# EAGLE schematic motor_connector_board (EAGLE 8.5.0)
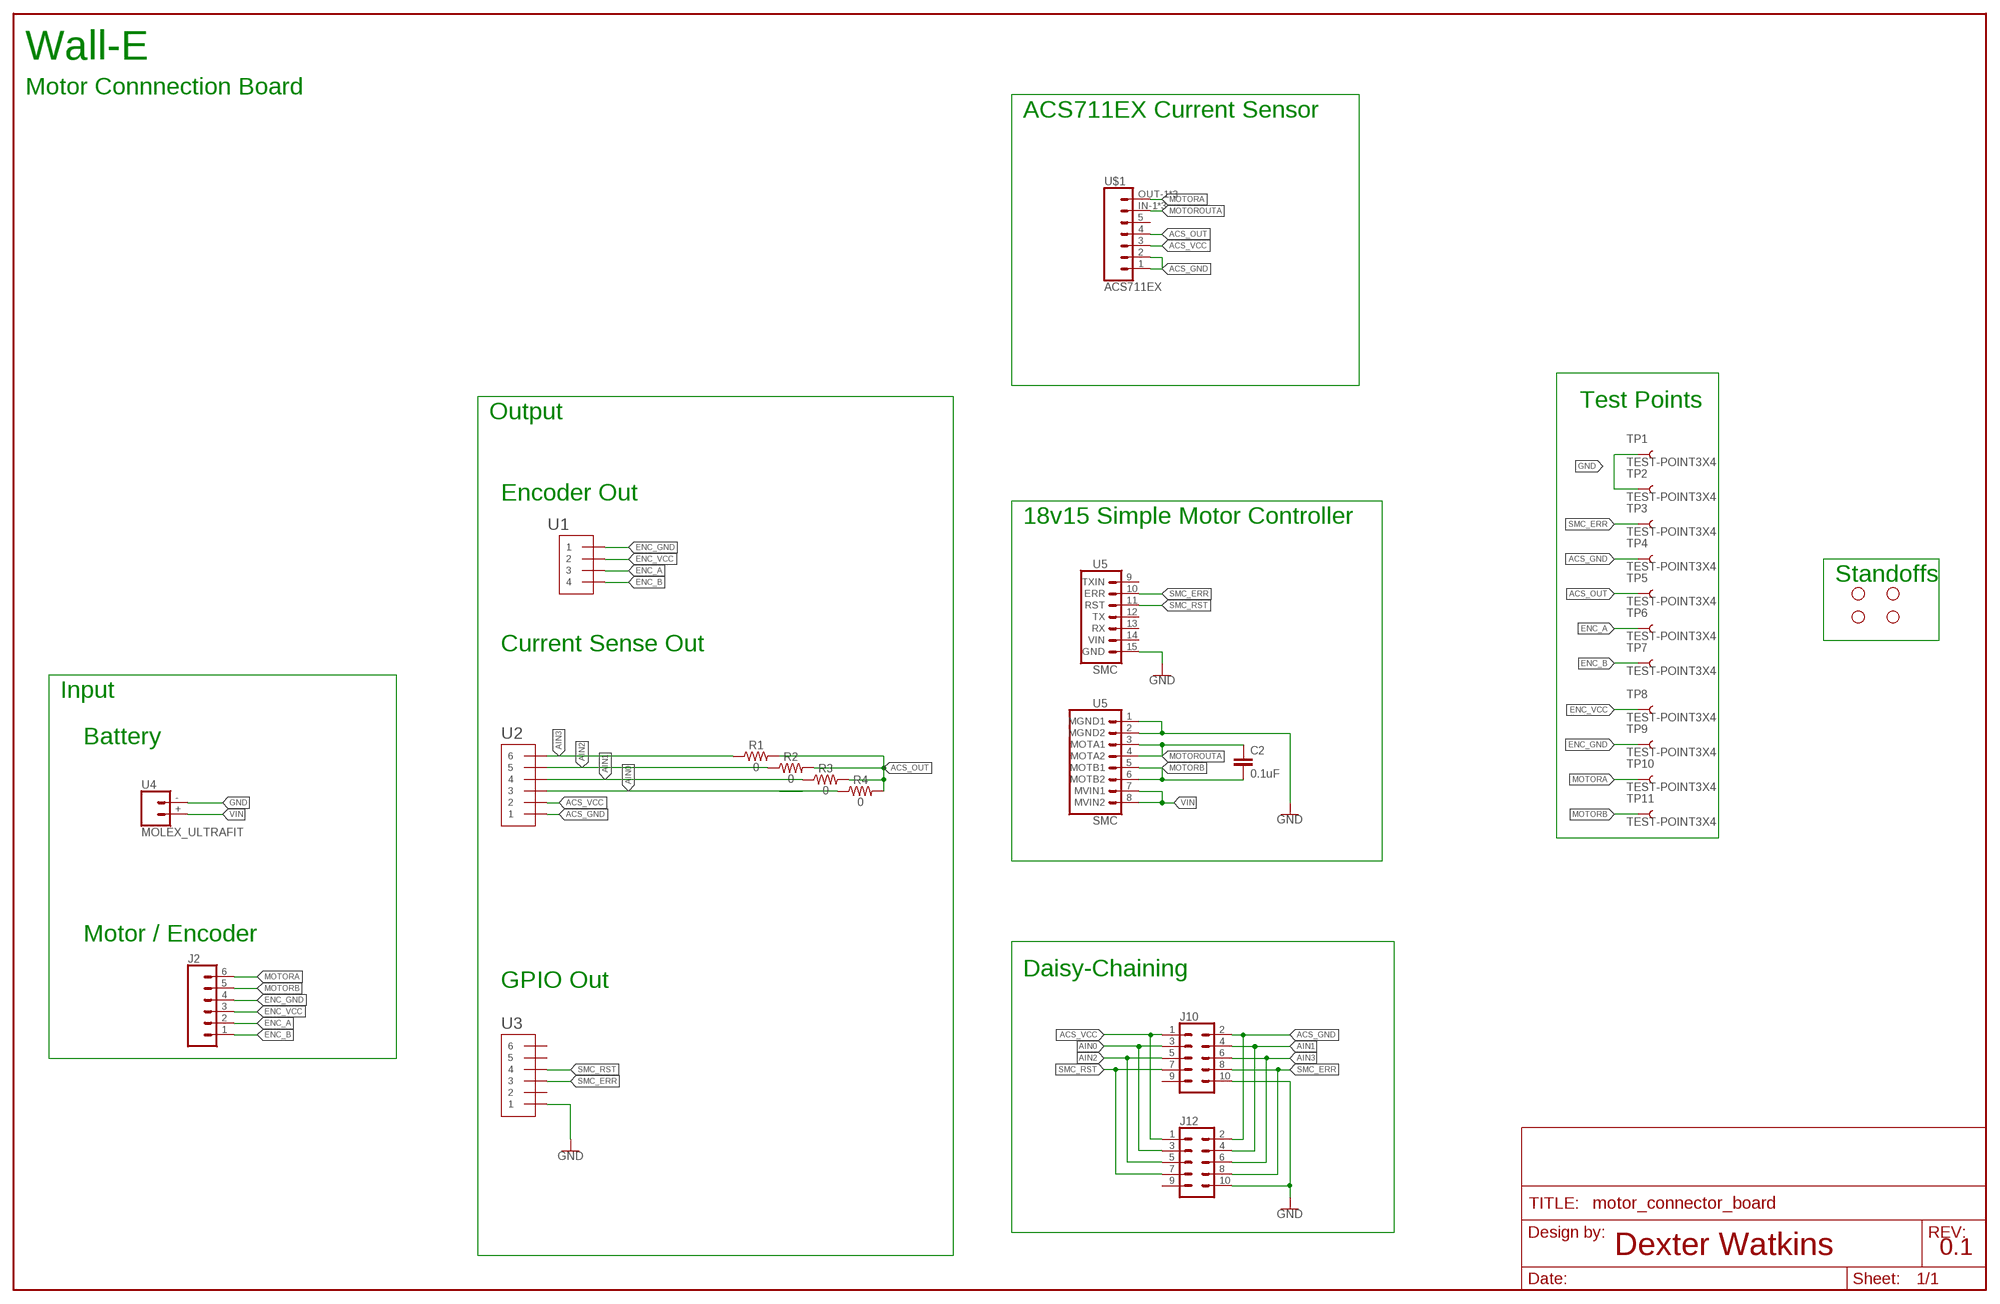
[diagram p0: schematic, sheet 1]

## Parts
C2  0.1uF  1.0NF/1000PF-0603-50V-10%  [0603]
FRAME1  FRAME-LEDGER  [CREATIVE_COMMONS]
H1  STAND-OFF  [STAND-OFF]
H2  STAND-OFF  [STAND-OFF]
H3  STAND-OFF  [STAND-OFF]
H4  STAND-OFF  [STAND-OFF]
J2  CONN_06LONGPADS  [1X06_LONGPADS]
J10  CONN_05X2SHD_LOCK  [2X5-SHROUDED_LOCK]
J12  CONN_05X2SHD_LOCK  [2X5-SHROUDED_LOCK]
R1  0  0OHM-0603-1/10W-5%  [0603]
R2  0  0OHM-0603-1/10W-5%  [0603]
R3  0  0OHM-0603-1/10W-5%  [0603]
R4  0  0OHM-0603-1/10W-5%  [0603]
TP1  TEST-POINT3X4  [PAD.03X.04]
TP2  TEST-POINT3X4  [PAD.03X.04]
TP3  TEST-POINT3X4  [PAD.03X.04]
TP4  TEST-POINT3X4  [PAD.03X.04]
TP5  TEST-POINT3X4  [PAD.03X.04]
TP6  TEST-POINT3X4  [PAD.03X.04]
TP7  TEST-POINT3X4  [PAD.03X.04]
TP8  TEST-POINT3X4  [PAD.03X.04]
TP9  TEST-POINT3X4  [PAD.03X.04]
TP10  TEST-POINT3X4  [PAD.03X.04]
TP11  TEST-POINT3X4  [PAD.03X.04]
U1  JST_SH_4  [JST_SH_4_SMD]
U2  JST_SH_6  [JST_SH_6]
U3  JST_SH_6  [JST_SH_6]
U4  MOLEX_ULTRAFIT  [MOLEX_ULTRAFIT-2CKT]
U5  SMC  [SMC]
U$1  ACS711EX  [ACS_CURRENT_SENSOR]

## Nets
ACS_GND: J10.2 J12.2 TP4.P$1 U2.1 U$1.1 U$1.2
ACS_OUT: R1.2 R2.2 R3.2 R4.2 TP5.P$1 U$1.4
ACS_VCC: J10.1 J12.1 U2.2 U$1.3
AIN0: J10.3 J12.3 R4.1 U2.3
AIN1: J10.4 J12.4 R3.1 U2.4
AIN2: J10.5 J12.5 R2.1 U2.5
AIN3: J10.6 J12.6 R1.1 U2.6
ENC_A: J2.2 TP6.P$1 U1.3
ENC_B: J2.1 TP7.P$1 U1.4
ENC_GND: J2.4 TP9.P$1 U1.1
ENC_VCC: J2.3 TP8.P$1 U1.2
GND: J10.10 J12.10 TP1.P$1 TP2.P$1 U3.1 U4.- U5.1(MGND1) U5.2(MGND2) U5.15(GND)
MOTORA: J2.6 TP10.P$1 U$1.OUT-1 U$1.OUT-2 U$1.OUT-3
MOTORB: C2.2 J2.5 TP11.P$1 U5.5(MOTB1) U5.6(MOTB2)
MOTOROUTA: C2.1 U5.3(MOTA1) U5.4(MOTA2) U$1.IN-1 U$1.IN-2 U$1.IN-3
SMC_ERR: J10.8 J12.8 TP3.P$1 U3.3 U5.10(ERR)
SMC_RST: J10.7 J12.7 U3.4 U5.11(RST)
VIN: U4.+ U5.7(MVIN1) U5.8(MVIN2)
Unconnected: J10.9 J12.9 U3.2 U3.5 U3.6 U5.9(TXIN) U5.12(TX) U5.13(RX) U5.14(VIN) U$1.5

## Notes on the sheet
- Wall-E
- Motor Connnection Board
- ACS711EX Current Sensor
- Test Points
- Output
- Encoder Out
- 18v15 Simple Motor Controller
- Standoffs
- Current Sense Out
- Input
- Battery
- Motor / Encoder
- Daisy-Chaining
- GPIO Out
- Dexter Watkins | 0.1

## Library data of the parts
C2 = SparkFun-Capacitors:1.0NF/1000PF: 1nF/1,000pF ceramic capacitors A capacitor is a passive two-terminal electrical component used to store electrical energy temporarily in an electric field.; PROD_ID: CAP-07886; VALUE: 1nF
FRAME1 = SparkFun-Aesthetics:FRAME-LEDGER: Schematic Frame - Ledger Standard 11x14 US Ledger frame
H1-H4 = SparkFun-Hardware:STAND-OFF: Stand Off Drill holes for mechanically mounting via screws, standoffs, etc. Note: Use the keepout ring to avoid running the screw head into surrounding components. Variant Overviews STAND-OFF - Mechanical footprint for a #4 phillips button head screw. STAND-OFF-TIGHT - Mechanical footprint for a #4 phillips button head screw, Example SparkFun Products Screw - Phillips Head (1/4", 4-40, 10 pack) <https://www.sparkfun.com/products/10453> (PRT-10453) Screw - Phillips Head (1/2", 4-40, 10 pack) <https://www.sparkfun.com/products/10452> (PRT-10452) Screw - Phillips Head (3/4", 4-40, 10 pack) <https://www.sparkfun.com/products/10451> (PRT-10451) Screw - Phillips Head (1", 4-40, 10 pack) <https://www.sparkfun.com/products/10450> (PRT-10450)
J2 = SparkFun-Connectors:CONN_06: Multi connection point. Often used as Generic Header-pin footprint for 0.1 inch spaced/style header connections On any of the 0.1 inch spaced packages, you can populate with these: Break Away Headers - Straight <https://www.sparkfun.com/products/116> (PRT-00116) Break Away Male Headers - Right Angle <https://www.sparkfun.com/products/553> (PRT-00553) Female Headers <https://www.sparkfun.com/products/115> (PRT-00115) Break Away Headers - Machine Pin <https://www.sparkfun.com/products/117> (PRT-00117) Break Away Female Headers - Swiss Machine Pin <https://www.sparkfun.com/products/743> (PRT-00743) Arduino Stackable Header - 6 Pin <https://www.sparkfun.com/products/9280> (PRT-09280) For SCREWTERMINALS and SPRING TERMINALS visit here: Screw Terimnals on SparkFun.com <https://www.sparkfun.com/search/results?term=Screw+Terminals> (5mm/3.5mm/2.54mm spacing) This device is also useful as a general connection point to wire up your design to another part of your project. Our various solder wires solder well into these plated through hole pads. Hook-Up Wire - Assortment (Stranded, 22 AWG) <https://www.sparkfun.com/products/11375> (PRT-11375) Hook-Up Wire - Assortment (Solid Core, 22 AWG) <https://www.sparkfun.com/products/11367> (PRT-11367) View the entire wire category on our website here <https://www.sparkfun.com/categories/141>
J10 J12 = SparkFun-Connectors:CONN_05X2: Multi connection point. Often used as Generic Header-pin footprint for 0.1 inch spaced/style header connections For AVR SPI programming port, see special device with nice symbol: "AVR_SPI_PROG_5x2.dev" You can populate with any combo of single row headers, but if you'd like an exact match, check these: 2x5 AVR ICSP Male Header <https://www.sparkfun.com/products/778> (PRT-00778) 2x5 Pin Shrouded Header <https://www.sparkfun.com/products/8506> (PRT-08506) On any of the 0.1 inch spaced packages, you can populate with these: Break Away Headers - Straight <https://www.sparkfun.com/products/116> (PRT-00116) Break Away Male Headers - Right Angle <https://www.sparkfun.com/products/553> (PRT-00553) Female Headers <https://www.sparkfun.com/products/115> (PRT-00115) Break Away Headers - Machine Pin <https://www.sparkfun.com/products/117> (PRT-00117) Break Away Female Headers - Swiss Machine Pin <https://www.sparkfun.com/products/743> (PRT-00743) Special note: the shrouded connector mates well with our 5x2 ribbon cables: 2x5 Pin IDC Ribbon Cable <https://www.sparkfun.com/products/8535> (PRT-08535); PROD_ID: CONN-08671; SF_ID: PRT-08506
R1-R4 = SparkFun-Resistors:0OHM: 0Ω resistor A resistor is a passive two-terminal electrical component that implements electrical resistance as a circuit element. Resistors act to reduce current flow, and, at the same time, act to lower voltage levels within circuits. - Wikipedia; PROD_ID: RES-08609
TP1-TP11 = SparkFun-Connectors:TEST-POINT: SparkFun Test Points Bare copper test points for troubleshooting or In-Circuit-Testing. These are used by our Production team for verifying production board runs using pogo-pins on test beds. SparkFun Products: SparkFun LSM9DS1 Breakout <https://www.sparkfun.com/products/13284> SparkFun PSOC <https://www.sparkfun.com/products/13714> SparkFun Load Cell Amplifier <https://www.sparkfun.com/products/13879>
U1 = Strawson_Eagle_Lib:JST_SH_4
U2 U3 = Strawson_Eagle_Lib:JST_SH_6
U4 = WallE_Motor_Board:MOLEX_ULTRAFIT
U5 = WallE_Motor_Board:SMC
U$1 = WallE_Motor_Board:ACS711EX

## Net classes
0 default: width 0.152 mm, drill 0.254 mm, clearance 0.152 mm
1 ground: width 0.152 mm, drill 0.254 mm, clearance 0.152 mm
3 power: width 0.152 mm, drill 0.254 mm, clearance 0.152 mm